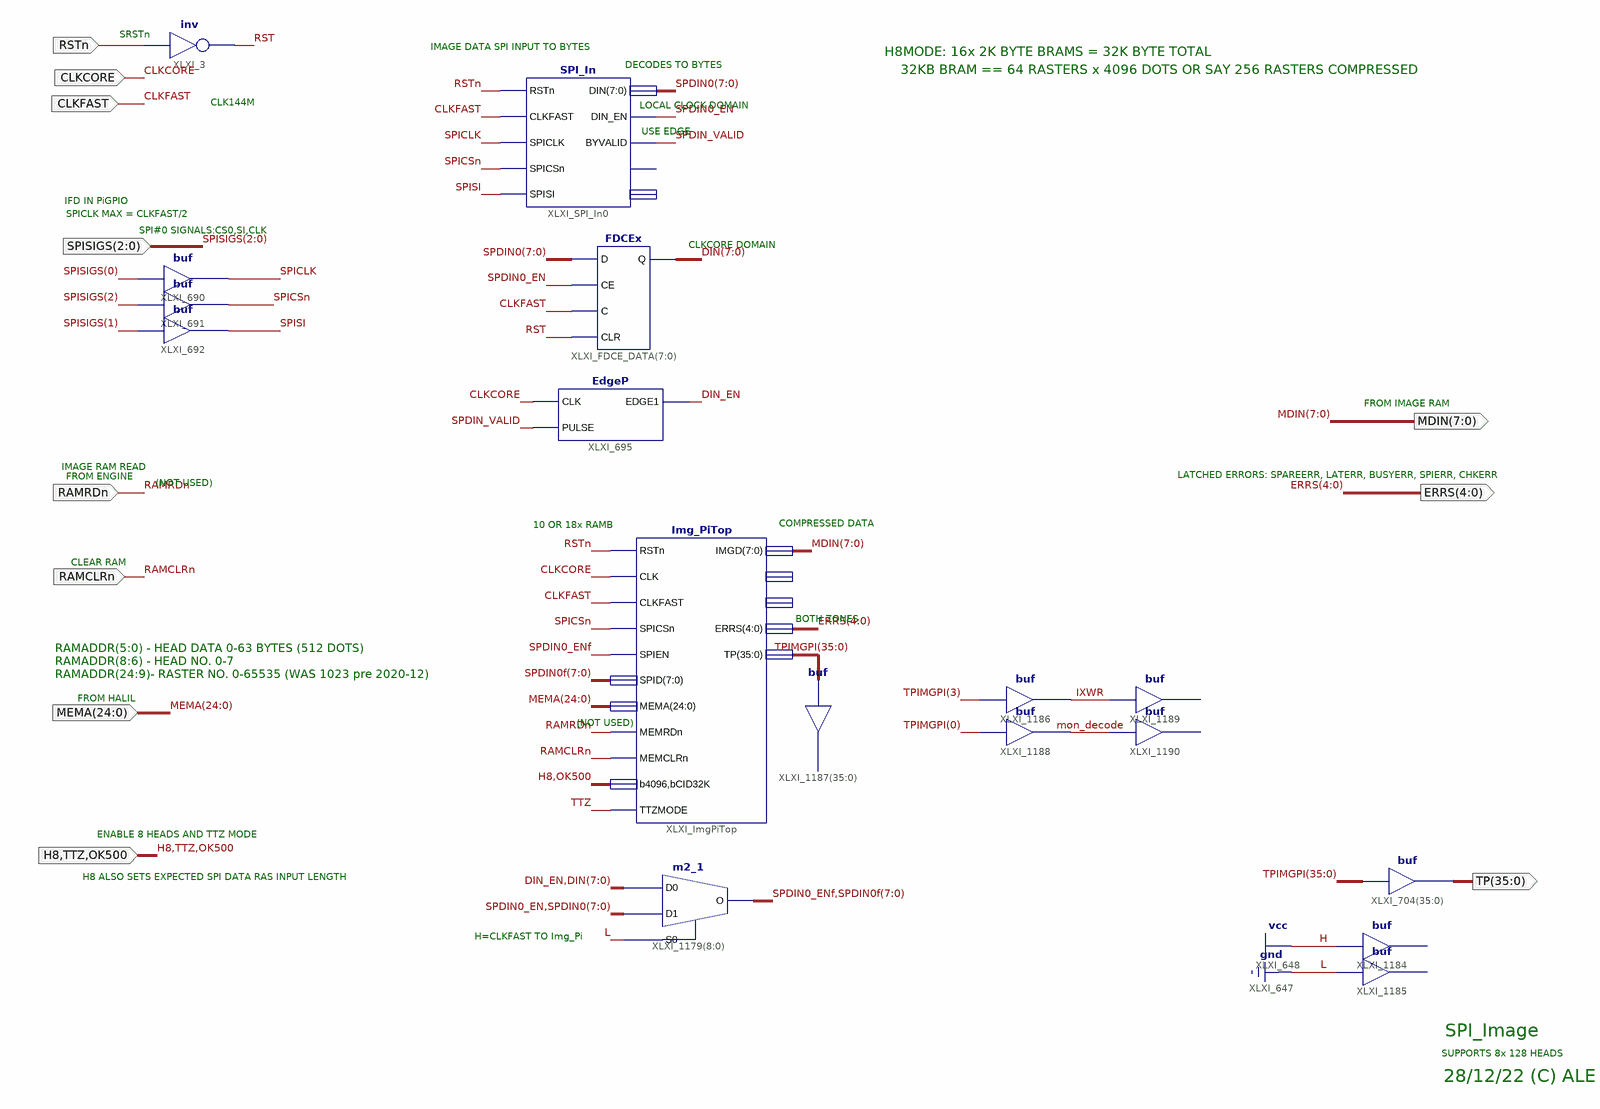
[diagram p0: schematic sheet 1]
// Xilinx ISE schematic SPI_Image.sch (spartan3e) as structural Verilog: 17 symbols, 11 ports
module SPI_Image (
  input  CLKCORE,
  input  RSTn,
  input  [2:0] SPISIGS,
  input  CLKFAST,
  input  RAMRDn,
  input  RAMCLRn,
  input  [24:0] MEMA,
  input  H8,
  input  TTZ,
  input  OK500,
  output [35:0] TP,
  output [7:0] MDIN,
  output [4:0] ERRS
);

  wire DIN_EN, IXWR, mon_decode, RST, SPDIN0_EN, SPDIN0_ENf, SPDIN_VALID, SPICLK, SPICSn, SPISI;
  wire [7:0] DIN, SPDIN0, SPDIN0f;
  wire [35:0] TPIMGPI;

  not XLXI_3 (RST, RSTn);
  SPI_In XLXI_SPI_In0 (
    .BYVALID(SPDIN_VALID), .CLKFAST(CLKFAST), .DIN(SPDIN0), .DIN_EN(SPDIN0_EN), .RSTn(RSTn), .SPICLK(SPICLK),
    .SPICSn(SPICSn), .SPISI(SPISI));  // open: CSEDGE, TP
  FDCEx XLXI_FDCE_DATA[7:0] (.C(CLKFAST), .CE(SPDIN0_EN), .CLR(RST), .D(SPDIN0), .Q(DIN));
  EdgeP XLXI_695 (.CLK(CLKCORE), .EDGE1(DIN_EN), .PULSE(SPDIN_VALID));
  buf XLXI_691 (SPICSn, SPISIGS[2]);
  buf XLXI_692 (SPISI, SPISIGS[1]);
  buf XLXI_690 (SPICLK, SPISIGS[0]);
  assign TP = TPIMGPI;  // buf XLXI_704[35..0], 36 bits wide
  m2_1 XLXI_1179[8:0] (.D0({DIN_EN, DIN}), .D1({SPDIN0_EN, SPDIN0}), .S0(1'b0), .O({SPDIN0_ENf, SPDIN0f}));
  // buf XLXI_1184 has open pins: I=1'b1, O=open
  // buf XLXI_1185 has open pins: I=1'b0, O=open
  buf XLXI_1186 (IXWR, TPIMGPI[3]);
  buf XLXI_1188 (mon_decode, TPIMGPI[0]);
  // buf XLXI_1189 has open pins: I=IXWR, O=open
  // buf XLXI_1190 has open pins: I=mon_decode, O=open
  Img_PiTop XLXI_ImgPiTop (
    .CLK(CLKCORE), .CLKFAST(CLKFAST), .ERRS(ERRS), .b4096(H8), .bCID32K(OK500), .IMGD(MDIN), .MEMA(MEMA),
    .MEMCLRn(RAMCLRn), .MEMRDn(RAMRDn), .RSTn(RSTn), .SPICSn(SPICSn), .SPID(SPDIN0f), .SPIEN(SPDIN0_ENf),
    .TP(TPIMGPI), .TTZMODE(TTZ));  // open: ERRS_0, ERRS_1
  // buf XLXI_1187[35..0] has open pins: I=TPIMGPI, O=open

  // Notes on the sheet:
  //   SRSTn
  //   IMAGE DATA SPI INPUT TO BYTES
  //   H8MODE: 16x 2K BYTE BRAMS = 32K BYTE TOTAL
  //   DECODES TO BYTES
  //   32KB BRAM == 64 RASTERS x 4096 DOTS OR SAY 256 RASTERS COMPRESSED
  //   CLK144M
  //   LOCAL CLOCK DOMAIN
  //   USE EDGE
  //   IFD IN PiGPIO
  //   SPICLK MAX = CLKFAST/2
  //   SPI#0 SIGNALS:CS0,SI,CLK
  //   CLKCORE DOMAIN
  //   FROM IMAGE RAM
  //   IMAGE RAM READ
  //   LATCHED ERRORS: SPAREERR, LATERR, BUSYERR, SPIERR, CHKERR
  //   FROM ENGINE
  //   (NOT USED)
  //   COMPRESSED DATA
  //   10 OR 18x RAMB
  //   CLEAR RAM
  //   BOTH ZONES
  //   RAMADDR(5:0) - HEAD DATA 0-63 BYTES (512 DOTS)
  //   RAMADDR(8:6) - HEAD NO. 0-7
  //   RAMADDR(24:9)- RASTER NO. 0-65535 (WAS 1023 pre 2020-12)
  //   FROM HALIL
  //   (NOT USED)
  //   ENABLE 8 HEADS AND TTZ MODE
  //   H8 ALSO SETS EXPECTED SPI DATA RAS INPUT LENGTH
  //   H=CLKFAST TO Img_Pi
  //   SPI_Image
  //   SUPPORTS 8x 128 HEADS
  //   28/12/22 (C) ALE
endmodule
